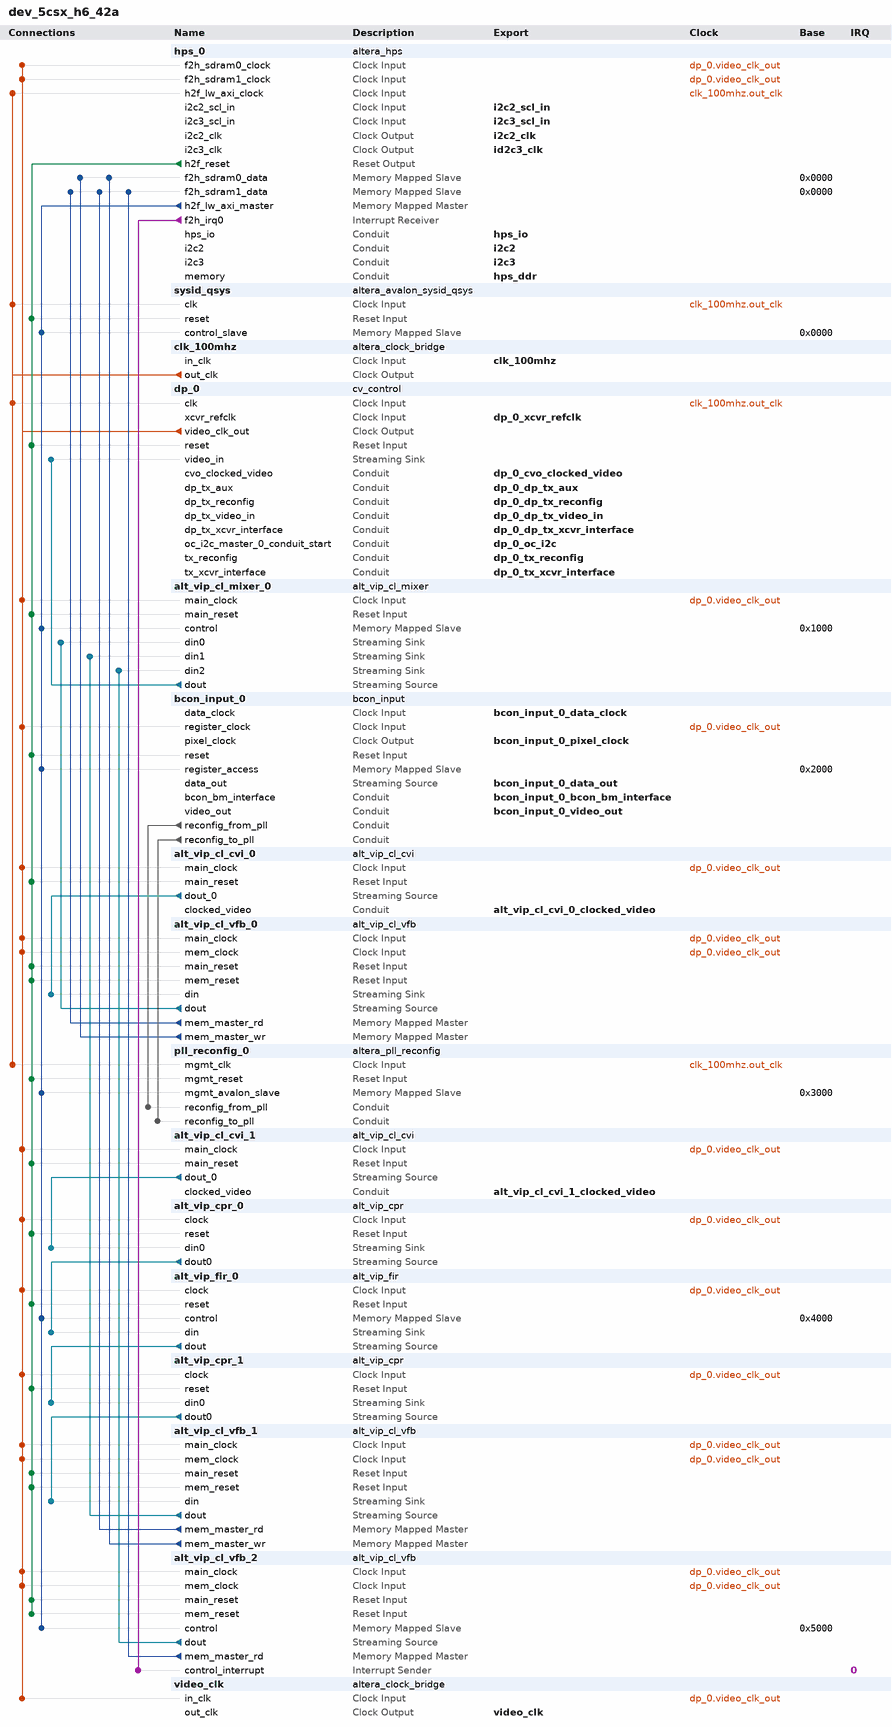
[diagram p0: system contents]
# Platform Designer (Qsys) system dev_5csx_h6_42a, Cyclone V 5CSXFC6C6U23C7
# Parameters at their usual value, and those the tool derives, are not listed.
package require -exact qsys 16.0
create_system dev_5csx_h6_42a
set_project_property DEVICE_FAMILY {Cyclone V}
set_project_property DEVICE 5CSXFC6C6U23C7

add_instance hps_0 altera_hps 16.0
set_instance_parameter_value hps_0 CAN0_Mode CAN
set_instance_parameter_value hps_0 CAN0_PinMuxing {HPS I/O Set 0}
set_instance_parameter_value hps_0 CAN1_Mode CAN
set_instance_parameter_value hps_0 CAN1_PinMuxing {HPS I/O Set 1}
set_instance_parameter_value hps_0 EMAC1_Mode RGMII
set_instance_parameter_value hps_0 EMAC1_PinMuxing {HPS I/O Set 0}
set_instance_parameter_value hps_0 F2SCLK_COLDRST_Enable false
set_instance_parameter_value hps_0 F2SCLK_DBGRST_Enable false
set_instance_parameter_value hps_0 F2SCLK_WARMRST_Enable false
set_instance_parameter_value hps_0 F2SDRAM_Type {Avalon-MM Write-Only,Avalon-MM Read-Only}
set_instance_parameter_value hps_0 F2SDRAM_Width 128,128
set_instance_parameter_value hps_0 F2SINTERRUPT_Enable true
set_instance_parameter_value hps_0 F2S_Width 0
set_instance_parameter_value hps_0 FPGA_PERIPHERAL_OUTPUT_CLOCK_FREQ_EMAC0_GTX_CLK 100
set_instance_parameter_value hps_0 FPGA_PERIPHERAL_OUTPUT_CLOCK_FREQ_EMAC0_MD_CLK 100.0
set_instance_parameter_value hps_0 FPGA_PERIPHERAL_OUTPUT_CLOCK_FREQ_EMAC1_GTX_CLK 100
set_instance_parameter_value hps_0 FPGA_PERIPHERAL_OUTPUT_CLOCK_FREQ_EMAC1_MD_CLK 100.0
set_instance_parameter_value hps_0 HPS_PROTOCOL DDR3
set_instance_parameter_value hps_0 I2C0_Mode I2C
set_instance_parameter_value hps_0 I2C0_PinMuxing {HPS I/O Set 1}
set_instance_parameter_value hps_0 I2C1_Mode I2C
set_instance_parameter_value hps_0 I2C1_PinMuxing {HPS I/O Set 0}
set_instance_parameter_value hps_0 I2C2_Mode Full
set_instance_parameter_value hps_0 I2C2_PinMuxing FPGA
set_instance_parameter_value hps_0 I2C3_Mode Full
set_instance_parameter_value hps_0 I2C3_PinMuxing FPGA
set_instance_parameter_value hps_0 LWH2F_Enable true
set_instance_parameter_value hps_0 MEM_BANKADDR_WIDTH 3
set_instance_parameter_value hps_0 MEM_CLK_FREQ 400.0
set_instance_parameter_value hps_0 MEM_COL_ADDR_WIDTH 10
set_instance_parameter_value hps_0 MEM_DQ_WIDTH 40
set_instance_parameter_value hps_0 MEM_DRV_STR RZQ/7
set_instance_parameter_value hps_0 MEM_ROW_ADDR_WIDTH 15
set_instance_parameter_value hps_0 MEM_RTT_NOM RZQ/4
set_instance_parameter_value hps_0 MEM_RTT_WR {Dynamic ODT off}
set_instance_parameter_value hps_0 MEM_TCL 7
set_instance_parameter_value hps_0 MEM_TFAW_NS 30.0
set_instance_parameter_value hps_0 MEM_TRAS_NS 35.0
set_instance_parameter_value hps_0 MEM_TRCD_NS 13.75
set_instance_parameter_value hps_0 MEM_TRFC_NS 260.0
set_instance_parameter_value hps_0 MEM_TRP_NS 13.75
set_instance_parameter_value hps_0 MEM_TRRD_NS 10.0
set_instance_parameter_value hps_0 MEM_TRTP_NS 10.0
set_instance_parameter_value hps_0 MEM_VENDOR JEDEC
set_instance_parameter_value hps_0 MEM_VOLTAGE {1.35V DDR3L}
set_instance_parameter_value hps_0 MEM_WTCL 6
set_instance_parameter_value hps_0 QSPI_Mode {2 SS}
set_instance_parameter_value hps_0 QSPI_PinMuxing {HPS I/O Set 1}
set_instance_parameter_value hps_0 REF_CLK_FREQ 25.0
set_instance_parameter_value hps_0 S2FCLK_USER2CLK 1
set_instance_parameter_value hps_0 S2F_Width 0
set_instance_parameter_value hps_0 SDIO_Mode {4-bit Data}
set_instance_parameter_value hps_0 SDIO_PinMuxing {HPS I/O Set 0}
set_instance_parameter_value hps_0 SPIM1_Mode N/A
set_instance_parameter_value hps_0 SPIM1_PinMuxing Unused
set_instance_parameter_value hps_0 STM_Enable false
set_instance_parameter_value hps_0 TIMING_BOARD_AC_SKEW 0.0
set_instance_parameter_value hps_0 TIMING_BOARD_AC_TO_CK_SKEW 0.0
set_instance_parameter_value hps_0 TIMING_BOARD_DQ_TO_DQS_SKEW 0.0
set_instance_parameter_value hps_0 TIMING_BOARD_MAX_CK_DELAY 0.6
set_instance_parameter_value hps_0 TIMING_BOARD_MAX_DQS_DELAY 0.2
set_instance_parameter_value hps_0 TIMING_BOARD_SKEW_BETWEEN_DQS 0.01
set_instance_parameter_value hps_0 TIMING_BOARD_SKEW_CKDQS_DIMM_MAX 0.215
set_instance_parameter_value hps_0 TIMING_BOARD_SKEW_CKDQS_DIMM_MIN 0.092
set_instance_parameter_value hps_0 TIMING_BOARD_SKEW_WITHIN_DQS 0.0
set_instance_parameter_value hps_0 TIMING_TDH 45
set_instance_parameter_value hps_0 TIMING_TDQSCK 225
set_instance_parameter_value hps_0 TIMING_TDQSQ 100
set_instance_parameter_value hps_0 TIMING_TDQSS 0.27
set_instance_parameter_value hps_0 TIMING_TDS 10
set_instance_parameter_value hps_0 TIMING_TDSH 0.18
set_instance_parameter_value hps_0 TIMING_TDSS 0.18
set_instance_parameter_value hps_0 TIMING_TIH 120
set_instance_parameter_value hps_0 TIMING_TIS 170
set_instance_parameter_value hps_0 TIMING_TQSH 0.4
set_instance_parameter_value hps_0 UART0_Mode {No Flow Control}
set_instance_parameter_value hps_0 UART0_PinMuxing {HPS I/O Set 2}
set_instance_parameter_value hps_0 USB1_Mode SDR
set_instance_parameter_value hps_0 USB1_PinMuxing {HPS I/O Set 0}
set_instance_parameter_value hps_0 desired_cfg_clk_mhz 100.0
set_instance_parameter_value hps_0 desired_qspi_clk_mhz 400.0

add_instance sysid_qsys altera_avalon_sysid_qsys 16.0
set_instance_parameter_value sysid_qsys id 1

add_instance clk_100mhz altera_clock_bridge 16.0
set_instance_parameter_value clk_100mhz DERIVED_CLOCK_RATE 0
set_instance_parameter_value clk_100mhz EXPLICIT_CLOCK_RATE 100000000

add_instance dp_0 cv_control 1.0

add_instance alt_vip_cl_mixer_0 alt_vip_cl_mixer 16.0
set_instance_parameter_value alt_vip_cl_mixer_0 ALPHA_ENABLE 1
set_instance_parameter_value alt_vip_cl_mixer_0 ALPHA_STREAMS_ENABLE 0
set_instance_parameter_value alt_vip_cl_mixer_0 BITS_PER_SYMBOL 8
set_instance_parameter_value alt_vip_cl_mixer_0 COLOR_PLANES_ARE_IN_PARALLEL 1
set_instance_parameter_value alt_vip_cl_mixer_0 COLOR_SPACE RGB
set_instance_parameter_value alt_vip_cl_mixer_0 FAMILY {Cyclone V}
set_instance_parameter_value alt_vip_cl_mixer_0 IS_422 1
set_instance_parameter_value alt_vip_cl_mixer_0 LAYER_POSITION_ENABLE 1
set_instance_parameter_value alt_vip_cl_mixer_0 MAX_HEIGHT 1080
set_instance_parameter_value alt_vip_cl_mixer_0 MAX_WIDTH 1920
set_instance_parameter_value alt_vip_cl_mixer_0 NO_OF_INPUTS 3
set_instance_parameter_value alt_vip_cl_mixer_0 NUMBER_OF_COLOR_PLANES 2
set_instance_parameter_value alt_vip_cl_mixer_0 PATTERN uniform
set_instance_parameter_value alt_vip_cl_mixer_0 PIPELINE_READY 0
set_instance_parameter_value alt_vip_cl_mixer_0 PIXELS_IN_PARALLEL 1
set_instance_parameter_value alt_vip_cl_mixer_0 UNIFORM_VALUE_BCR 0
set_instance_parameter_value alt_vip_cl_mixer_0 UNIFORM_VALUE_GCB 0
set_instance_parameter_value alt_vip_cl_mixer_0 UNIFORM_VALUE_RY 0
set_instance_parameter_value alt_vip_cl_mixer_0 USER_PACKET_FIFO_DEPTH 0
set_instance_parameter_value alt_vip_cl_mixer_0 USER_PACKET_SUPPORT DISCARD

add_instance bcon_input_0 bcon_input 1.1
set_instance_parameter_value bcon_input_0 g_lane_invert 30

add_instance alt_vip_cl_cvi_0 alt_vip_cl_cvi 16.0
set_instance_parameter_value alt_vip_cl_cvi_0 ACCEPT_COLOURS_IN_SEQ 0
set_instance_parameter_value alt_vip_cl_cvi_0 ANC_DEPTH 1
set_instance_parameter_value alt_vip_cl_cvi_0 BPS 8
set_instance_parameter_value alt_vip_cl_cvi_0 CLOCKS_ARE_SAME 0
set_instance_parameter_value alt_vip_cl_cvi_0 COLOUR_PLANES_ARE_IN_PARALLEL 1
set_instance_parameter_value alt_vip_cl_cvi_0 EXTRACT_TOTAL_RESOLUTION 1
set_instance_parameter_value alt_vip_cl_cvi_0 FIFO_DEPTH 2048
set_instance_parameter_value alt_vip_cl_cvi_0 GENERATE_ANC 0
set_instance_parameter_value alt_vip_cl_cvi_0 GENERATE_VID_F 0
set_instance_parameter_value alt_vip_cl_cvi_0 H_ACTIVE_PIXELS_F0 1920
set_instance_parameter_value alt_vip_cl_cvi_0 INTERLACED 0
set_instance_parameter_value alt_vip_cl_cvi_0 NO_OF_CHANNELS 1
set_instance_parameter_value alt_vip_cl_cvi_0 NUMBER_OF_COLOUR_PLANES 3
set_instance_parameter_value alt_vip_cl_cvi_0 PIXELS_IN_PARALLEL 1
set_instance_parameter_value alt_vip_cl_cvi_0 STD_WIDTH 1
set_instance_parameter_value alt_vip_cl_cvi_0 SYNC_TO 0
set_instance_parameter_value alt_vip_cl_cvi_0 USE_CONTROL 0
set_instance_parameter_value alt_vip_cl_cvi_0 USE_EMBEDDED_SYNCS 0
set_instance_parameter_value alt_vip_cl_cvi_0 USE_HDMI_DEPRICATION 0
set_instance_parameter_value alt_vip_cl_cvi_0 USE_STD 0
set_instance_parameter_value alt_vip_cl_cvi_0 V_ACTIVE_LINES_F0 1080
set_instance_parameter_value alt_vip_cl_cvi_0 V_ACTIVE_LINES_F1 480

add_instance alt_vip_cl_vfb_0 alt_vip_cl_vfb 16.0
set_instance_parameter_value alt_vip_cl_vfb_0 CLOCKS_ARE_SEPARATE 1
set_instance_parameter_value alt_vip_cl_vfb_0 DROP_FRAMES 1
set_instance_parameter_value alt_vip_cl_vfb_0 DROP_REPEAT_USER 0
set_instance_parameter_value alt_vip_cl_vfb_0 IS_FRAME_READER 0
set_instance_parameter_value alt_vip_cl_vfb_0 MAX_HEIGHT 1080
set_instance_parameter_value alt_vip_cl_vfb_0 MAX_WIDTH 1920
set_instance_parameter_value alt_vip_cl_vfb_0 MEM_BASE_ADDR 536870912
set_instance_parameter_value alt_vip_cl_vfb_0 MEM_BUFFER_OFFSET 16777216
set_instance_parameter_value alt_vip_cl_vfb_0 MEM_PORT_WIDTH 128
set_instance_parameter_value alt_vip_cl_vfb_0 READER_RUNTIME_CONTROL 0
set_instance_parameter_value alt_vip_cl_vfb_0 READ_FIFO_DEPTH 64
set_instance_parameter_value alt_vip_cl_vfb_0 USER_PACKETS_MAX_STORAGE 0
set_instance_parameter_value alt_vip_cl_vfb_0 USE_BUFFER_OFFSET 0
set_instance_parameter_value alt_vip_cl_vfb_0 WRITE_BURST_TARGET 32
set_instance_parameter_value alt_vip_cl_vfb_0 WRITE_FIFO_DEPTH 64

add_instance pll_reconfig_0 altera_pll_reconfig 16.0

add_instance alt_vip_cl_cvi_1 alt_vip_cl_cvi 16.0
set_instance_parameter_value alt_vip_cl_cvi_1 ACCEPT_COLOURS_IN_SEQ 0
set_instance_parameter_value alt_vip_cl_cvi_1 ANC_DEPTH 1
set_instance_parameter_value alt_vip_cl_cvi_1 BPS 8
set_instance_parameter_value alt_vip_cl_cvi_1 CLOCKS_ARE_SAME 0
set_instance_parameter_value alt_vip_cl_cvi_1 COLOUR_PLANES_ARE_IN_PARALLEL 1
set_instance_parameter_value alt_vip_cl_cvi_1 EXTRACT_TOTAL_RESOLUTION 1
set_instance_parameter_value alt_vip_cl_cvi_1 FIFO_DEPTH 2048
set_instance_parameter_value alt_vip_cl_cvi_1 GENERATE_ANC 0
set_instance_parameter_value alt_vip_cl_cvi_1 GENERATE_VID_F 0
set_instance_parameter_value alt_vip_cl_cvi_1 H_ACTIVE_PIXELS_F0 1920
set_instance_parameter_value alt_vip_cl_cvi_1 INTERLACED 0
set_instance_parameter_value alt_vip_cl_cvi_1 NO_OF_CHANNELS 1
set_instance_parameter_value alt_vip_cl_cvi_1 NUMBER_OF_COLOUR_PLANES 3
set_instance_parameter_value alt_vip_cl_cvi_1 PIXELS_IN_PARALLEL 1
set_instance_parameter_value alt_vip_cl_cvi_1 STD_WIDTH 1
set_instance_parameter_value alt_vip_cl_cvi_1 SYNC_TO 0
set_instance_parameter_value alt_vip_cl_cvi_1 USE_CONTROL 0
set_instance_parameter_value alt_vip_cl_cvi_1 USE_EMBEDDED_SYNCS 0
set_instance_parameter_value alt_vip_cl_cvi_1 USE_HDMI_DEPRICATION 0
set_instance_parameter_value alt_vip_cl_cvi_1 USE_STD 0
set_instance_parameter_value alt_vip_cl_cvi_1 V_ACTIVE_LINES_F0 1080
set_instance_parameter_value alt_vip_cl_cvi_1 V_ACTIVE_LINES_F1 480

add_instance alt_vip_cpr_0 alt_vip_cpr 13.1
set_instance_parameter_value alt_vip_cpr_0 DIN0_SYMBOLS_PER_BEAT 3
set_instance_parameter_value alt_vip_cpr_0 DIN1_ENABLED 0
set_instance_parameter_value alt_vip_cpr_0 DIN1_SYMBOLS_PER_BEAT 0
set_instance_parameter_value alt_vip_cpr_0 DOUT0_SYMBOLS_PER_BEAT 1
set_instance_parameter_value alt_vip_cpr_0 DOUT1_ENABLED 0
set_instance_parameter_value alt_vip_cpr_0 DOUT1_SYMBOLS_PER_BEAT 0
set_instance_parameter_value alt_vip_cpr_0 PARAMETERISATION {<colourPatternRearrangerParams><CPR_NAME>Color Plane Sequencer</CPR_NAME><CPR_BPS>8</CPR_BPS><CPR_PORTS><INPUT_PORT><NAME>din0</NAME><STREAMING_DESCRIPTOR>[Y:Cb:Cr]</STREAMING_DESCRIPTOR><ENABLED>true</ENABLED></INPUT_PORT><INPUT_PORT><NAME>din1</NAME><STREAMING_DESCRIPTOR>[Channel]</STREAMING_DESCRIPTOR><ENABLED>false</ENABLED></INPUT_PORT><OUTPUT_PORT><NAME>dout0</NAME><STREAMING_DESCRIPTOR>[Y,Cb,Cr]</STREAMING_DESCRIPTOR><ENABLED>true</ENABLED><NON_IMAGE_PACKET_SOURCE>din0</NON_IMAGE_PACKET_SOURCE><HALVE_WIDTH>false</HALVE_WIDTH></OUTPUT_PORT><OUTPUT_PORT><NAME>dout1</NAME><STREAMING_DESCRIPTOR>[Channel]</STREAMING_DESCRIPTOR><ENABLED>false</ENABLED><NON_IMAGE_PACKET_SOURCE>din0</NON_IMAGE_PACKET_SOURCE><HALVE_WIDTH>false</HALVE_WIDTH></OUTPUT_PORT></CPR_PORTS><CPR_INPUT_2_PIXELS>false</CPR_INPUT_2_PIXELS></colourPatternRearrangerParams>}

add_instance alt_vip_fir_0 alt_vip_fir 13.1
set_instance_parameter_value alt_vip_fir_0 PARAMETERISATION {<firParams><FIR_NAME>finite_impulse_response</FIR_NAME><FIR_WIDTH>960</FIR_WIDTH><FIR_CHANNELS_IN_SEQ>3</FIR_CHANNELS_IN_SEQ><FIR_INPUT_OUTPUT_DATATYPES><IODT_INPUT_BPS>8</IODT_INPUT_BPS><IODT_OUTPUT_BPS>8</IODT_OUTPUT_BPS><IODT_INPUT_DATA_TYPE>DATA_TYPE_UNSIGNED</IODT_INPUT_DATA_TYPE><IODT_OUTPUT_DATA_TYPE>DATA_TYPE_UNSIGNED</IODT_OUTPUT_DATA_TYPE><IODT_USE_INPUT_GUARD_BANDS>false</IODT_USE_INPUT_GUARD_BANDS><IODT_INPUT_GUARD_MIN>0</IODT_INPUT_GUARD_MIN><IODT_INPUT_GUARD_MAX>255</IODT_INPUT_GUARD_MAX><IODT_USE_OUTPUT_GUARD_BANDS>true</IODT_USE_OUTPUT_GUARD_BANDS><IODT_OUTPUT_GUARD_MIN>0</IODT_OUTPUT_GUARD_MIN><IODT_OUTPUT_GUARD_MAX>255</IODT_OUTPUT_GUARD_MAX></FIR_INPUT_OUTPUT_DATATYPES><FIR_FILTER_SIZE>5</FIR_FILTER_SIZE><FIR_SYMMETRIC_MODE>true</FIR_SYMMETRIC_MODE><FIR_COEFFS_MODEL>SIMPLE_SMOOTHING</FIR_COEFFS_MODEL><FIR_COEFFS><kRow> <k>-0.25</k><k>-0.25</k><k>-0.25</k> </kRow><kRow> <k>-0.25</k><k>2.0</k><k>-0.25</k> </kRow><kRow> <k>-0.25</k><k>-0.25</k><k>-0.25</k> </kRow></FIR_COEFFS><FIR_COEFFS_PRECISION><CPC_INTEGER_BITS>5</CPC_INTEGER_BITS><CPC_FRACTION_BITS>1</CPC_FRACTION_BITS><CPC_COEFFS_SIGNED>true</CPC_COEFFS_SIGNED></FIR_COEFFS_PRECISION><FIR_OUTPUT_CONVERSION><ODTC_SCALE>0</ODTC_SCALE><ODTC_FIXEDPOINT_TO_INTEGER>FRACTION_BITS_ROUND_HALF_UP</ODTC_FIXEDPOINT_TO_INTEGER><ODTC_CONVERT_SIGNED_TO_UNSIGNED>CONVERT_TO_UNSIGNED_SATURATE</ODTC_CONVERT_SIGNED_TO_UNSIGNED></FIR_OUTPUT_CONVERSION><FIR_CONTROL_PORT>true</FIR_CONTROL_PORT></firParams>}

add_instance alt_vip_cpr_1 alt_vip_cpr 13.1
set_instance_parameter_value alt_vip_cpr_1 DIN0_SYMBOLS_PER_BEAT 1
set_instance_parameter_value alt_vip_cpr_1 DIN1_ENABLED 0
set_instance_parameter_value alt_vip_cpr_1 DIN1_SYMBOLS_PER_BEAT 0
set_instance_parameter_value alt_vip_cpr_1 DOUT0_SYMBOLS_PER_BEAT 3
set_instance_parameter_value alt_vip_cpr_1 DOUT1_ENABLED 0
set_instance_parameter_value alt_vip_cpr_1 DOUT1_SYMBOLS_PER_BEAT 0
set_instance_parameter_value alt_vip_cpr_1 PARAMETERISATION {<colourPatternRearrangerParams><CPR_NAME>Color Plane Sequencer</CPR_NAME><CPR_BPS>8</CPR_BPS><CPR_PORTS><INPUT_PORT><NAME>din0</NAME><STREAMING_DESCRIPTOR>[Y,U,unnamed]</STREAMING_DESCRIPTOR><ENABLED>true</ENABLED></INPUT_PORT><INPUT_PORT><NAME>din1</NAME><STREAMING_DESCRIPTOR>[Channel]</STREAMING_DESCRIPTOR><ENABLED>false</ENABLED></INPUT_PORT><OUTPUT_PORT><NAME>dout0</NAME><STREAMING_DESCRIPTOR>[Y:U:unnamed]</STREAMING_DESCRIPTOR><ENABLED>true</ENABLED><NON_IMAGE_PACKET_SOURCE>din0</NON_IMAGE_PACKET_SOURCE><HALVE_WIDTH>false</HALVE_WIDTH></OUTPUT_PORT><OUTPUT_PORT><NAME>dout1</NAME><STREAMING_DESCRIPTOR>[Channel]</STREAMING_DESCRIPTOR><ENABLED>false</ENABLED><NON_IMAGE_PACKET_SOURCE>din0</NON_IMAGE_PACKET_SOURCE><HALVE_WIDTH>false</HALVE_WIDTH></OUTPUT_PORT></CPR_PORTS><CPR_INPUT_2_PIXELS>false</CPR_INPUT_2_PIXELS></colourPatternRearrangerParams>}

add_instance alt_vip_cl_vfb_1 alt_vip_cl_vfb 16.0
set_instance_parameter_value alt_vip_cl_vfb_1 CLOCKS_ARE_SEPARATE 1
set_instance_parameter_value alt_vip_cl_vfb_1 DROP_FRAMES 1
set_instance_parameter_value alt_vip_cl_vfb_1 DROP_REPEAT_USER 0
set_instance_parameter_value alt_vip_cl_vfb_1 IS_FRAME_READER 0
set_instance_parameter_value alt_vip_cl_vfb_1 MAX_HEIGHT 1080
set_instance_parameter_value alt_vip_cl_vfb_1 MAX_WIDTH 1920
set_instance_parameter_value alt_vip_cl_vfb_1 MEM_BASE_ADDR 570425344
set_instance_parameter_value alt_vip_cl_vfb_1 MEM_BUFFER_OFFSET 16777216
set_instance_parameter_value alt_vip_cl_vfb_1 MEM_PORT_WIDTH 128
set_instance_parameter_value alt_vip_cl_vfb_1 READER_RUNTIME_CONTROL 0
set_instance_parameter_value alt_vip_cl_vfb_1 READ_FIFO_DEPTH 64
set_instance_parameter_value alt_vip_cl_vfb_1 USER_PACKETS_MAX_STORAGE 0
set_instance_parameter_value alt_vip_cl_vfb_1 USE_BUFFER_OFFSET 0
set_instance_parameter_value alt_vip_cl_vfb_1 WRITE_BURST_TARGET 32
set_instance_parameter_value alt_vip_cl_vfb_1 WRITE_FIFO_DEPTH 64

add_instance alt_vip_cl_vfb_2 alt_vip_cl_vfb 16.0
set_instance_parameter_value alt_vip_cl_vfb_2 CLOCKS_ARE_SEPARATE 1
set_instance_parameter_value alt_vip_cl_vfb_2 DROP_FRAMES 0
set_instance_parameter_value alt_vip_cl_vfb_2 DROP_REPEAT_USER 0
set_instance_parameter_value alt_vip_cl_vfb_2 IS_FRAME_READER 1
set_instance_parameter_value alt_vip_cl_vfb_2 MAX_HEIGHT 1080
set_instance_parameter_value alt_vip_cl_vfb_2 MAX_WIDTH 1920
set_instance_parameter_value alt_vip_cl_vfb_2 MEM_BASE_ADDR 603979776
set_instance_parameter_value alt_vip_cl_vfb_2 MEM_BUFFER_OFFSET 16777216
set_instance_parameter_value alt_vip_cl_vfb_2 MEM_PORT_WIDTH 128
set_instance_parameter_value alt_vip_cl_vfb_2 READER_RUNTIME_CONTROL 1
set_instance_parameter_value alt_vip_cl_vfb_2 READ_FIFO_DEPTH 64
set_instance_parameter_value alt_vip_cl_vfb_2 USER_PACKETS_MAX_STORAGE 0
set_instance_parameter_value alt_vip_cl_vfb_2 USE_BUFFER_OFFSET 0
set_instance_parameter_value alt_vip_cl_vfb_2 WRITE_BURST_TARGET 32
set_instance_parameter_value alt_vip_cl_vfb_2 WRITE_FIFO_DEPTH 64

add_instance video_clk altera_clock_bridge 16.0
set_instance_parameter_value video_clk DERIVED_CLOCK_RATE 154000000
set_instance_parameter_value video_clk EXPLICIT_CLOCK_RATE 0

# connections
add_connection clk_100mhz.out_clk dp_0.clk clock
add_connection clk_100mhz.out_clk hps_0.h2f_lw_axi_clock clock
add_connection clk_100mhz.out_clk pll_reconfig_0.mgmt_clk clock
add_connection clk_100mhz.out_clk sysid_qsys.clk clock
add_connection dp_0.video_clk_out alt_vip_cl_cvi_0.main_clock clock
add_connection dp_0.video_clk_out alt_vip_cl_cvi_1.main_clock clock
add_connection dp_0.video_clk_out alt_vip_cl_mixer_0.main_clock clock
add_connection dp_0.video_clk_out alt_vip_cl_vfb_0.main_clock clock
add_connection dp_0.video_clk_out alt_vip_cl_vfb_0.mem_clock clock
add_connection dp_0.video_clk_out alt_vip_cl_vfb_1.main_clock clock
add_connection dp_0.video_clk_out alt_vip_cl_vfb_1.mem_clock clock
add_connection dp_0.video_clk_out alt_vip_cl_vfb_2.main_clock clock
add_connection dp_0.video_clk_out alt_vip_cl_vfb_2.mem_clock clock
add_connection dp_0.video_clk_out alt_vip_cpr_0.clock clock
add_connection dp_0.video_clk_out alt_vip_cpr_1.clock clock
add_connection dp_0.video_clk_out alt_vip_fir_0.clock clock
add_connection dp_0.video_clk_out bcon_input_0.register_clock clock
add_connection dp_0.video_clk_out hps_0.f2h_sdram0_clock clock
add_connection dp_0.video_clk_out hps_0.f2h_sdram1_clock clock
add_connection dp_0.video_clk_out video_clk.in_clk clock
add_connection hps_0.h2f_reset alt_vip_cl_cvi_0.main_reset reset
add_connection hps_0.h2f_reset alt_vip_cl_cvi_1.main_reset reset
add_connection hps_0.h2f_reset alt_vip_cl_mixer_0.main_reset reset
add_connection hps_0.h2f_reset alt_vip_cl_vfb_0.main_reset reset
add_connection hps_0.h2f_reset alt_vip_cl_vfb_0.mem_reset reset
add_connection hps_0.h2f_reset alt_vip_cl_vfb_1.main_reset reset
add_connection hps_0.h2f_reset alt_vip_cl_vfb_1.mem_reset reset
add_connection hps_0.h2f_reset alt_vip_cl_vfb_2.main_reset reset
add_connection hps_0.h2f_reset alt_vip_cl_vfb_2.mem_reset reset
add_connection hps_0.h2f_reset alt_vip_cpr_0.reset reset
add_connection hps_0.h2f_reset alt_vip_cpr_1.reset reset
add_connection hps_0.h2f_reset alt_vip_fir_0.reset reset
add_connection hps_0.h2f_reset bcon_input_0.reset reset
add_connection hps_0.h2f_reset dp_0.reset reset
add_connection hps_0.h2f_reset pll_reconfig_0.mgmt_reset reset
add_connection hps_0.h2f_reset sysid_qsys.reset reset
add_connection alt_vip_cl_vfb_0.mem_master_rd hps_0.f2h_sdram1_data avalon
set_connection_parameter_value alt_vip_cl_vfb_0.mem_master_rd/hps_0.f2h_sdram1_data baseAddress 0x0000
add_connection alt_vip_cl_vfb_0.mem_master_wr hps_0.f2h_sdram0_data avalon
set_connection_parameter_value alt_vip_cl_vfb_0.mem_master_wr/hps_0.f2h_sdram0_data baseAddress 0x0000
add_connection alt_vip_cl_vfb_1.mem_master_rd hps_0.f2h_sdram1_data avalon
set_connection_parameter_value alt_vip_cl_vfb_1.mem_master_rd/hps_0.f2h_sdram1_data baseAddress 0x0000
add_connection alt_vip_cl_vfb_1.mem_master_wr hps_0.f2h_sdram0_data avalon
set_connection_parameter_value alt_vip_cl_vfb_1.mem_master_wr/hps_0.f2h_sdram0_data baseAddress 0x0000
add_connection alt_vip_cl_vfb_2.mem_master_rd hps_0.f2h_sdram1_data avalon
set_connection_parameter_value alt_vip_cl_vfb_2.mem_master_rd/hps_0.f2h_sdram1_data baseAddress 0x0000
add_connection hps_0.h2f_lw_axi_master alt_vip_cl_mixer_0.control avalon
set_connection_parameter_value hps_0.h2f_lw_axi_master/alt_vip_cl_mixer_0.control baseAddress 0x1000
add_connection hps_0.h2f_lw_axi_master alt_vip_cl_vfb_2.control avalon
set_connection_parameter_value hps_0.h2f_lw_axi_master/alt_vip_cl_vfb_2.control baseAddress 0x5000
add_connection hps_0.h2f_lw_axi_master alt_vip_fir_0.control avalon
set_connection_parameter_value hps_0.h2f_lw_axi_master/alt_vip_fir_0.control baseAddress 0x4000
add_connection hps_0.h2f_lw_axi_master bcon_input_0.register_access avalon
set_connection_parameter_value hps_0.h2f_lw_axi_master/bcon_input_0.register_access baseAddress 0x2000
add_connection hps_0.h2f_lw_axi_master pll_reconfig_0.mgmt_avalon_slave avalon
set_connection_parameter_value hps_0.h2f_lw_axi_master/pll_reconfig_0.mgmt_avalon_slave baseAddress 0x3000
add_connection hps_0.h2f_lw_axi_master sysid_qsys.control_slave avalon
set_connection_parameter_value hps_0.h2f_lw_axi_master/sysid_qsys.control_slave baseAddress 0x0000
add_connection alt_vip_cl_cvi_0.dout_0 alt_vip_cl_vfb_0.din avalon_streaming
add_connection alt_vip_cl_cvi_1.dout_0 alt_vip_cpr_0.din0 avalon_streaming
add_connection alt_vip_cl_mixer_0.dout dp_0.video_in avalon_streaming
add_connection alt_vip_cl_vfb_0.dout alt_vip_cl_mixer_0.din0 avalon_streaming
add_connection alt_vip_cl_vfb_1.dout alt_vip_cl_mixer_0.din1 avalon_streaming
add_connection alt_vip_cl_vfb_2.dout alt_vip_cl_mixer_0.din2 avalon_streaming
add_connection alt_vip_cpr_0.dout0 alt_vip_fir_0.din avalon_streaming
add_connection alt_vip_cpr_1.dout0 alt_vip_cl_vfb_1.din avalon_streaming
add_connection alt_vip_fir_0.dout alt_vip_cpr_1.din0 avalon_streaming
add_connection bcon_input_0.reconfig_from_pll pll_reconfig_0.reconfig_from_pll conduit
add_connection bcon_input_0.reconfig_to_pll pll_reconfig_0.reconfig_to_pll conduit
add_connection hps_0.f2h_irq0 alt_vip_cl_vfb_2.control_interrupt interrupt
set_connection_parameter_value hps_0.f2h_irq0/alt_vip_cl_vfb_2.control_interrupt irqNumber 0

# exported interfaces
add_interface alt_vip_cl_cvi_0_clocked_video conduit end
set_interface_property alt_vip_cl_cvi_0_clocked_video EXPORT_OF alt_vip_cl_cvi_0.clocked_video
add_interface alt_vip_cl_cvi_1_clocked_video conduit end
set_interface_property alt_vip_cl_cvi_1_clocked_video EXPORT_OF alt_vip_cl_cvi_1.clocked_video
add_interface bcon_input_0_bcon_bm_interface conduit end
set_interface_property bcon_input_0_bcon_bm_interface EXPORT_OF bcon_input_0.bcon_bm_interface
add_interface bcon_input_0_data_clock clock sink
set_interface_property bcon_input_0_data_clock EXPORT_OF bcon_input_0.data_clock
add_interface bcon_input_0_data_out avalon_streaming source
set_interface_property bcon_input_0_data_out EXPORT_OF bcon_input_0.data_out
add_interface bcon_input_0_pixel_clock clock source
set_interface_property bcon_input_0_pixel_clock EXPORT_OF bcon_input_0.pixel_clock
add_interface bcon_input_0_video_out conduit end
set_interface_property bcon_input_0_video_out EXPORT_OF bcon_input_0.video_out
add_interface clk_100mhz clock sink
set_interface_property clk_100mhz EXPORT_OF clk_100mhz.in_clk
add_interface dp_0_cvo_clocked_video conduit end
set_interface_property dp_0_cvo_clocked_video EXPORT_OF dp_0.cvo_clocked_video
add_interface dp_0_dp_tx_aux conduit end
set_interface_property dp_0_dp_tx_aux EXPORT_OF dp_0.dp_tx_aux
add_interface dp_0_dp_tx_reconfig conduit end
set_interface_property dp_0_dp_tx_reconfig EXPORT_OF dp_0.dp_tx_reconfig
add_interface dp_0_dp_tx_video_in conduit end
set_interface_property dp_0_dp_tx_video_in EXPORT_OF dp_0.dp_tx_video_in
add_interface dp_0_dp_tx_xcvr_interface conduit end
set_interface_property dp_0_dp_tx_xcvr_interface EXPORT_OF dp_0.dp_tx_xcvr_interface
add_interface dp_0_oc_i2c conduit end
set_interface_property dp_0_oc_i2c EXPORT_OF dp_0.oc_i2c_master_0_conduit_start
add_interface dp_0_tx_reconfig conduit end
set_interface_property dp_0_tx_reconfig EXPORT_OF dp_0.tx_reconfig
add_interface dp_0_tx_xcvr_interface conduit end
set_interface_property dp_0_tx_xcvr_interface EXPORT_OF dp_0.tx_xcvr_interface
add_interface dp_0_xcvr_refclk clock sink
set_interface_property dp_0_xcvr_refclk EXPORT_OF dp_0.xcvr_refclk
add_interface hps_ddr conduit end
set_interface_property hps_ddr EXPORT_OF hps_0.memory
add_interface hps_io conduit end
set_interface_property hps_io EXPORT_OF hps_0.hps_io
add_interface i2c2 conduit end
set_interface_property i2c2 EXPORT_OF hps_0.i2c2
add_interface i2c2_clk clock source
set_interface_property i2c2_clk EXPORT_OF hps_0.i2c2_clk
add_interface i2c2_scl_in clock sink
set_interface_property i2c2_scl_in EXPORT_OF hps_0.i2c2_scl_in
add_interface i2c3 conduit end
set_interface_property i2c3 EXPORT_OF hps_0.i2c3
add_interface i2c3_scl_in clock sink
set_interface_property i2c3_scl_in EXPORT_OF hps_0.i2c3_scl_in
add_interface id2c3_clk clock source
set_interface_property id2c3_clk EXPORT_OF hps_0.i2c3_clk
add_interface video_clk clock source
set_interface_property video_clk EXPORT_OF video_clk.out_clk

set_interconnect_requirement {$system} qsys_mm.clockCrossingAdapter HANDSHAKE
set_interconnect_requirement {$system} qsys_mm.maxAdditionalLatency 4

save_system dev_5csx_h6_42a.qsys
